# Altium project Memmory Address Register.PrjPcb
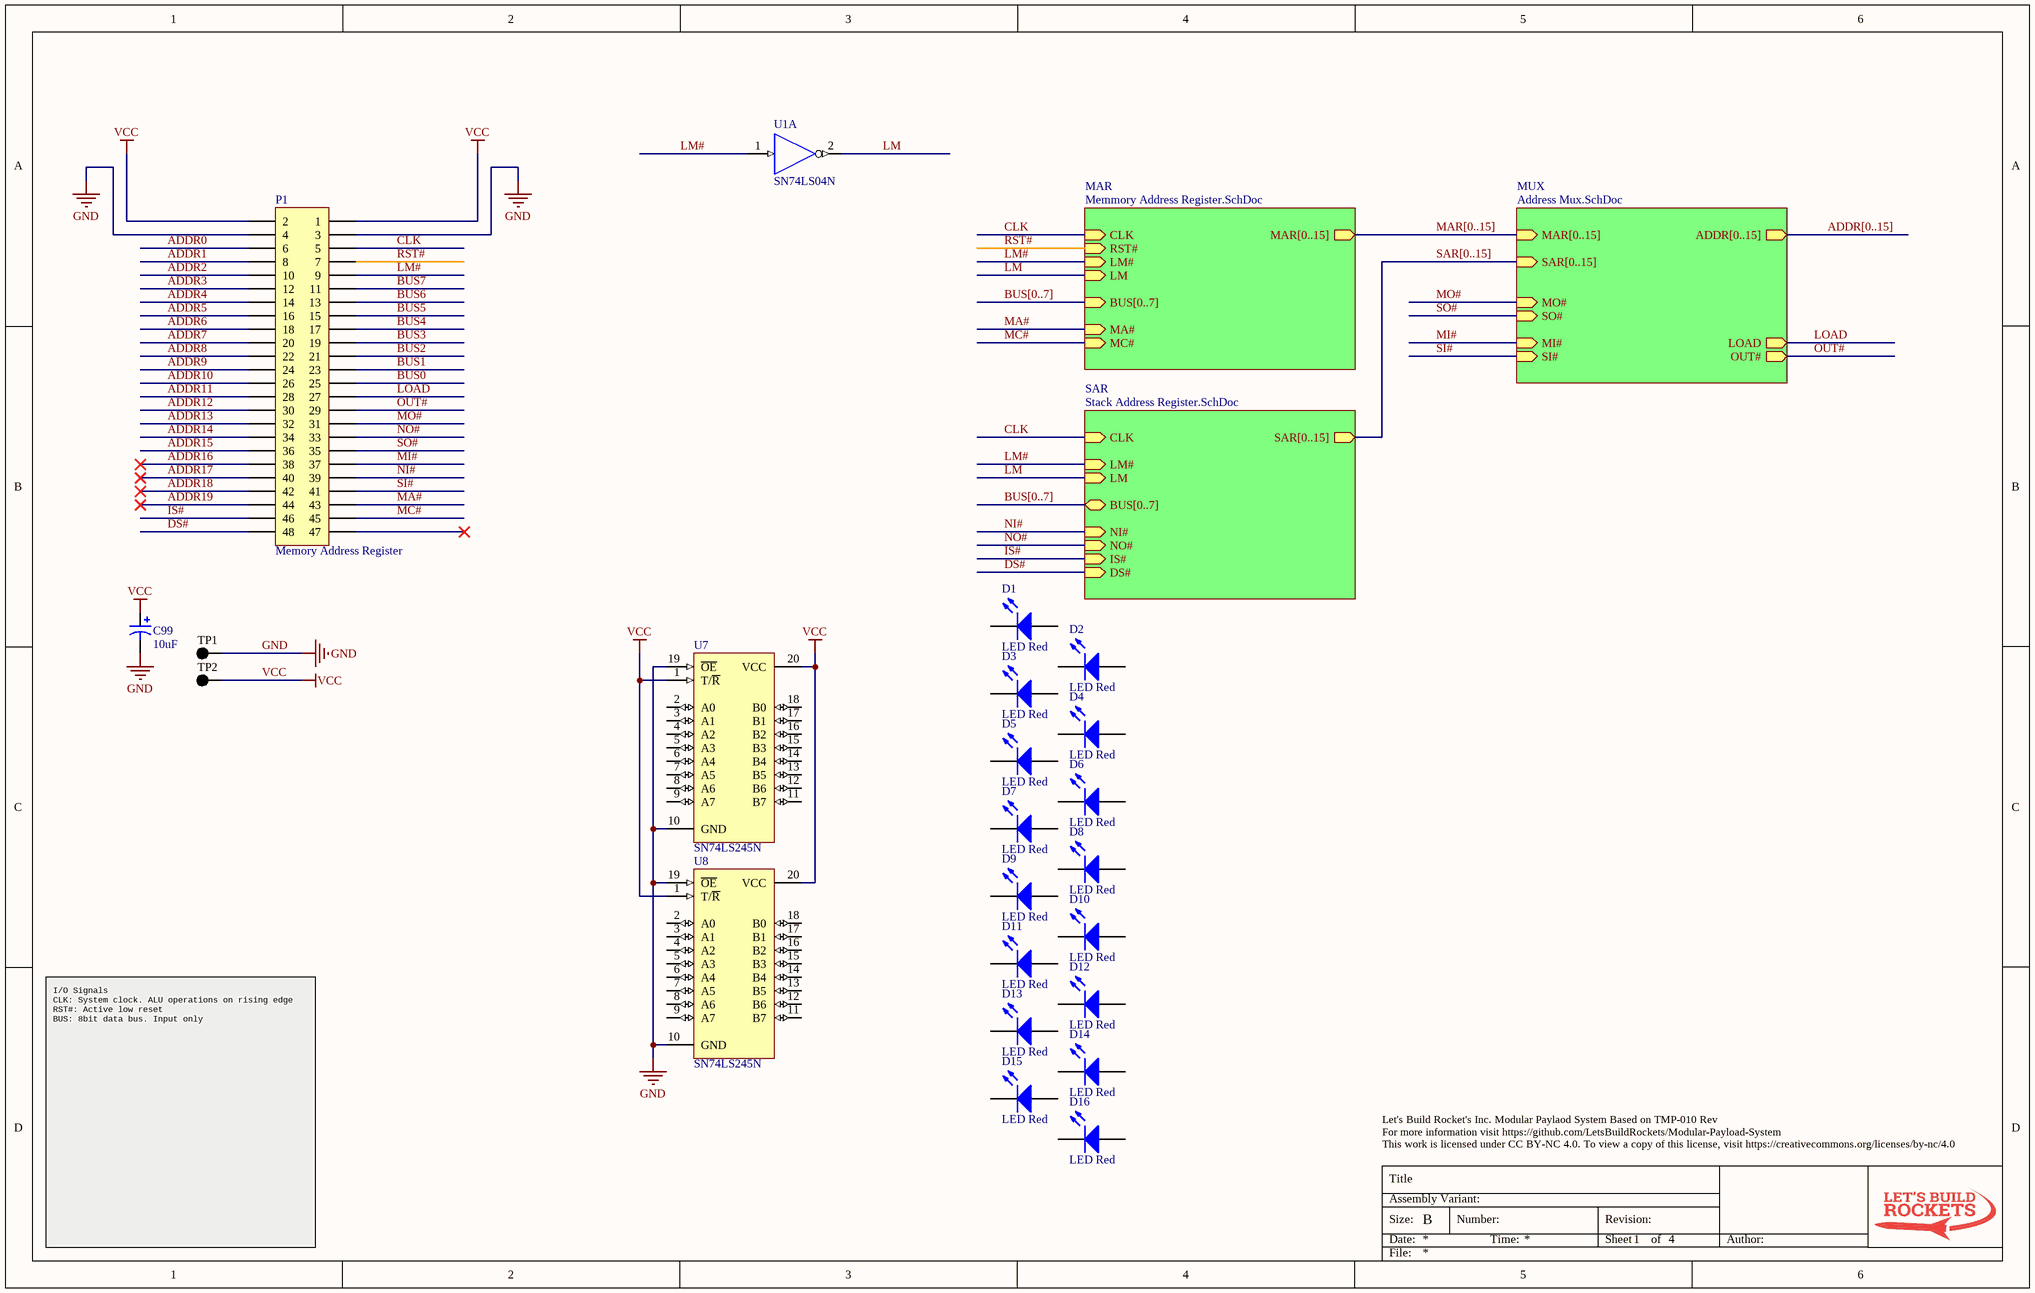
[diagram p0: Top.SchDoc]
4 sheets, 53 parts. Net scope: hierarchical (ports join the sheet entries above them; power ports are global).
Board file: Memmory Address Register.PcbDoc
Sheets:
  Top.SchDoc
    MAR = Memmory Address Register.SchDoc
    SAR = Stack Address Register.SchDoc
    MUX = Address Mux.SchDoc

## Sheet Top.SchDoc
size B; Author: E. Sims; Organization: Let's Build Rockets Inc.; SheetNumber: 1; SheetTotal: 4

### Parts
(Parts that share a designator on the sheet are numbered #1, #2 ... from top to bottom, then left to right.)
C99  value 10uF  [C5x7]  (hidden comment: Cap Pol5)
D1  LED Red  [LED 3mm RED]
D2  LED Red  [LED 3mm RED]
D3  LED Red  [LED 3mm RED]
D4  LED Red  [LED 3mm RED]
D5  LED Red  [LED 3mm RED]
D6  LED Red  [LED 3mm RED]
D7  LED Red  [LED 3mm RED]
D8  LED Red  [LED 3mm RED]
D9  LED Red  [LED 3mm RED]
D10  LED Red  [LED 3mm RED]
D11  LED Red  [LED 3mm RED]
D12  LED Red  [LED 3mm RED]
D13  LED Red  [LED 3mm RED]
D14  LED Red  [LED 3mm RED]
D15  LED Red  [LED 3mm RED]
D16  LED Red  [LED 3mm RED]
P1  Memory Address Register  [HDR2X24H]
TP1  (no value)  [KSTN-5011_V]
TP2  (no value)  [KSTN-5011_V]
U1#1  SN74LS04N  [N014]  (part A of 6)
U7  SN74LS245N  [N020]
U8  SN74LS245N  [N020]

### Sub-sheets
MAR = Memmory Address Register.SchDoc: CLK (in), MA# (in), LM# (in), MAR[0..15] (out), RST# (in), BUS[0..7] (in), MC# (in), LM (in)
MUX = Address Mux.SchDoc: MAR[0..15] (in), SAR[0..15] (in), ADDR[0..15] (out), LOAD (out), OUT# (out), MO# (in), SO# (in), MI# (in), SI# (in)
SAR = Stack Address Register.SchDoc: CLK (in), IS# (in), SAR[0..15] (out), DS# (in), NI# (in), BUS[0..7] (bidir), LM# (in), NO# (in), LM (in)

### Nets
GND: C99.2 P1.3 P1.4 TP1.1 U1#1.7(GND) U7.10(GND) U7.19(~{OE}) U8.10(GND) U8.19(~{OE})
VCC: C99.1 P1.1 P1.2 TP2.1 U1#1.14(VCC) U7.1(T/~{R}) U7.20(VCC) U8.1(T/~{R}) U8.20(VCC)
ADDR0: P1.6
ADDR1: P1.8
ADDR2: P1.10
ADDR3: P1.12
ADDR4: P1.14
ADDR5: P1.16
ADDR6: P1.18
ADDR7: P1.20
ADDR8: P1.22
ADDR9: P1.24
ADDR10: P1.26
ADDR11: P1.28
ADDR12: P1.30
ADDR13: P1.32
ADDR14: P1.34
ADDR15: P1.36
ADDR16: P1.38
ADDR17: P1.40
ADDR18: P1.42
ADDR19: P1.44
BUS0: P1.25
BUS1: P1.23
BUS2: P1.21
BUS3: P1.19
BUS4: P1.17
BUS5: P1.15
BUS6: P1.13
BUS7: P1.11
CLK: P1.5 ; sheet MAR/CLK, sheet SAR/CLK
DS#: P1.48 ; sheet SAR/DS#
IS#: P1.46 ; sheet SAR/IS#
LM: U1#1.2(Y) ; sheet MAR/LM, sheet SAR/LM
LM#: P1.9 U1#1.1(A) ; sheet MAR/LM#, sheet SAR/LM#
LOAD: P1.27 ; sheet MUX/LOAD
MA#: P1.43 ; sheet MAR/MA#
MC#: P1.45 ; sheet MAR/MC#
MI#: P1.37 ; sheet MUX/MI#
MO#: P1.31 ; sheet MUX/MO#
NI#: P1.39 ; sheet SAR/NI#
NO#: P1.33 ; sheet SAR/NO#
OUT#: P1.29 ; sheet MUX/OUT#
RST#: P1.7 ; sheet MAR/RST#
SI#: P1.41 ; sheet MUX/SI#
SO#: P1.35 ; sheet MUX/SO#

Not connected (* = marked no-connect by the designer): D1 1(A) 2(K); D2 1(A) 2(K); D3 1(A) 2(K); D4 1(A) 2(K); D5 1(A) 2(K); D6 1(A) 2(K); D7 1(A) 2(K); D8 1(A) 2(K); D9 1(A) 2(K); D10 1(A) 2(K); D11 1(A) 2(K); D12 1(A) 2(K); D13 1(A) 2(K); D14 1(A) 2(K); D15 1(A) 2(K); D16 1(A) 2(K); P1 47*; U7 2(A0) 3(A1) 4(A2) 5(A3) 6(A4) 7(A5) 8(A6) 9(A7) 11(B7) 12(B6) 13(B5) 14(B4) 15(B3) 16(B2) 17(B1) 18(B0); U8 2(A0) 3(A1) 4(A2) 5(A3) 6(A4) 7(A5) 8(A6) 9(A7) 11(B7) 12(B6) 13(B5) 14(B4) 15(B3) 16(B2) 17(B1) 18(B0)

### Buses and harness runs
bus ADDR[0..15] = sheet MUX/ADDR[0..15]
bus BUS[0..7] = sheet MAR/BUS[0..7]
bus BUS[0..7] = sheet SAR/BUS[0..7]
bus MAR[0..15] = sheet MAR/MAR[0..15] = sheet MUX/MAR[0..15]
bus SAR[0..15] = sheet MUX/SAR[0..15] = sheet SAR/SAR[0..15]

### Notes on the sheet
- I/O Signals
  CLK: System clock. ALU operations on rising edge
  RST#: Active low reset
  BUS: 8bit data bus. Input only
- Let's Build Rocket's Inc. Modular Paylaod System Based on TMP-010 Rev
  For more information visit https://github.com/LetsBuildRockets/Modular-Payload-System
  This work is licensed under CC BY-NC 4.0. To view a copy of this license, visit https://creativecommons.org/licenses/by-nc/4.0
- Title
- Size:
- Date:
- Assembly Variant:
- B
- Number:
- Time:
- Revision:
- Sheet
- of
- Author:
- File:

### Library data of the parts
C99 = Cap Pol5: Polarized Capacitor; Published: 8-Jun-2000; LatestRevisionDate: 17-Jul-2002; LatestRevisionNote: Re-released for DXP Platform.; PackageReference: POLAR0.8; Publisher: Altium Limited; PackageDescription: Polarized Capacitor; 2 Leads
D1-D16 = LED_Red
P1 = Header 24x2H: Header, 24-Pin, Dual row, Right Angle; System: Connector; LatestRevisionDate: 17-Jul-2002; LatestRevisionNote: Re-released for DXP Platform.; Publisher: Altium Limited
TP1 TP2 = CMP-1672-00003-4: Test Point, Black, Through Hole, RoHS, Bulk; Manufacturer: Keystone; ComponentLink2URL: http://www.keyelco.com/product-pdf.cfm?p=1320; Colour: Black; Pins: 1; REACH SVHC: No SVHC; ComponentLink1URL: http://www.keyelco.com/; PackageReference: 5011; Contact Plating: Silver; Package Quantity: 100; Packaging: Bulk; RoHSCompliant: true; Height: 8.12 mm; PackageDescription: 1-Pin Through Hole Device, Dia 3.17 mm; Mount: Through Hole; Mounting Technology: Through Hole; DatasheetVersion: Rev. F, 12/2013; ComponentLink1Description: Manufacturer URL; Contact Material: Bronze; ComponentLink2Description: Datasheet
U1#1 = SN74LS04N: Hex Inverter; Published: 8-Jun-2000; LatestRevisionDate: 04-Mar-2005; LatestRevisionNote: Stylized 3D Model Added.; DatasheetVersion: Mar-1988; PackageVersion: Oct-1995; PackageReference: N014; Publisher: Altium Limited; PackageDescription: DIP; 14 Leads; Row Spacing 7.62 mm; Pitch 2.54 mm; ComponentLink1Description: Manufacturer Link; ComponentLink1URL: http://www.ti.com/; ComponentLink2Description: Datasheet; ComponentLink2URL: http://www-s.ti.com/sc/ds/sn74ls04.pdf
U7 U8 = SN74LS245N: Octal Bus Transceiver with 3-State Outputs; Published: 8-Jun-2000; LatestRevisionDate: 04-Mar-2005; LatestRevisionNote: Stylized 3D Model Added.; DatasheetVersion: Mar-1988; PackageVersion: Oct-1995; PackageReference: N020; Publisher: Altium Limited; PackageDescription: DIP; 20 Leads; Row Spacing 7.62 mm; Pitch 2.54 mm; ComponentLink1Description: Manufacturer Link; ComponentLink1URL: http://www.ti.com/; ComponentLink2Description: Datasheet; ComponentLink2URL: http://www-s.ti.com/sc/ds/sn74ls245.pdf

## Sheet Memmory Address Register.SchDoc
size B; Author: E. Sims; Organization: Let's Build Rockets Inc.; SheetNumber: 2; SheetTotal: 2
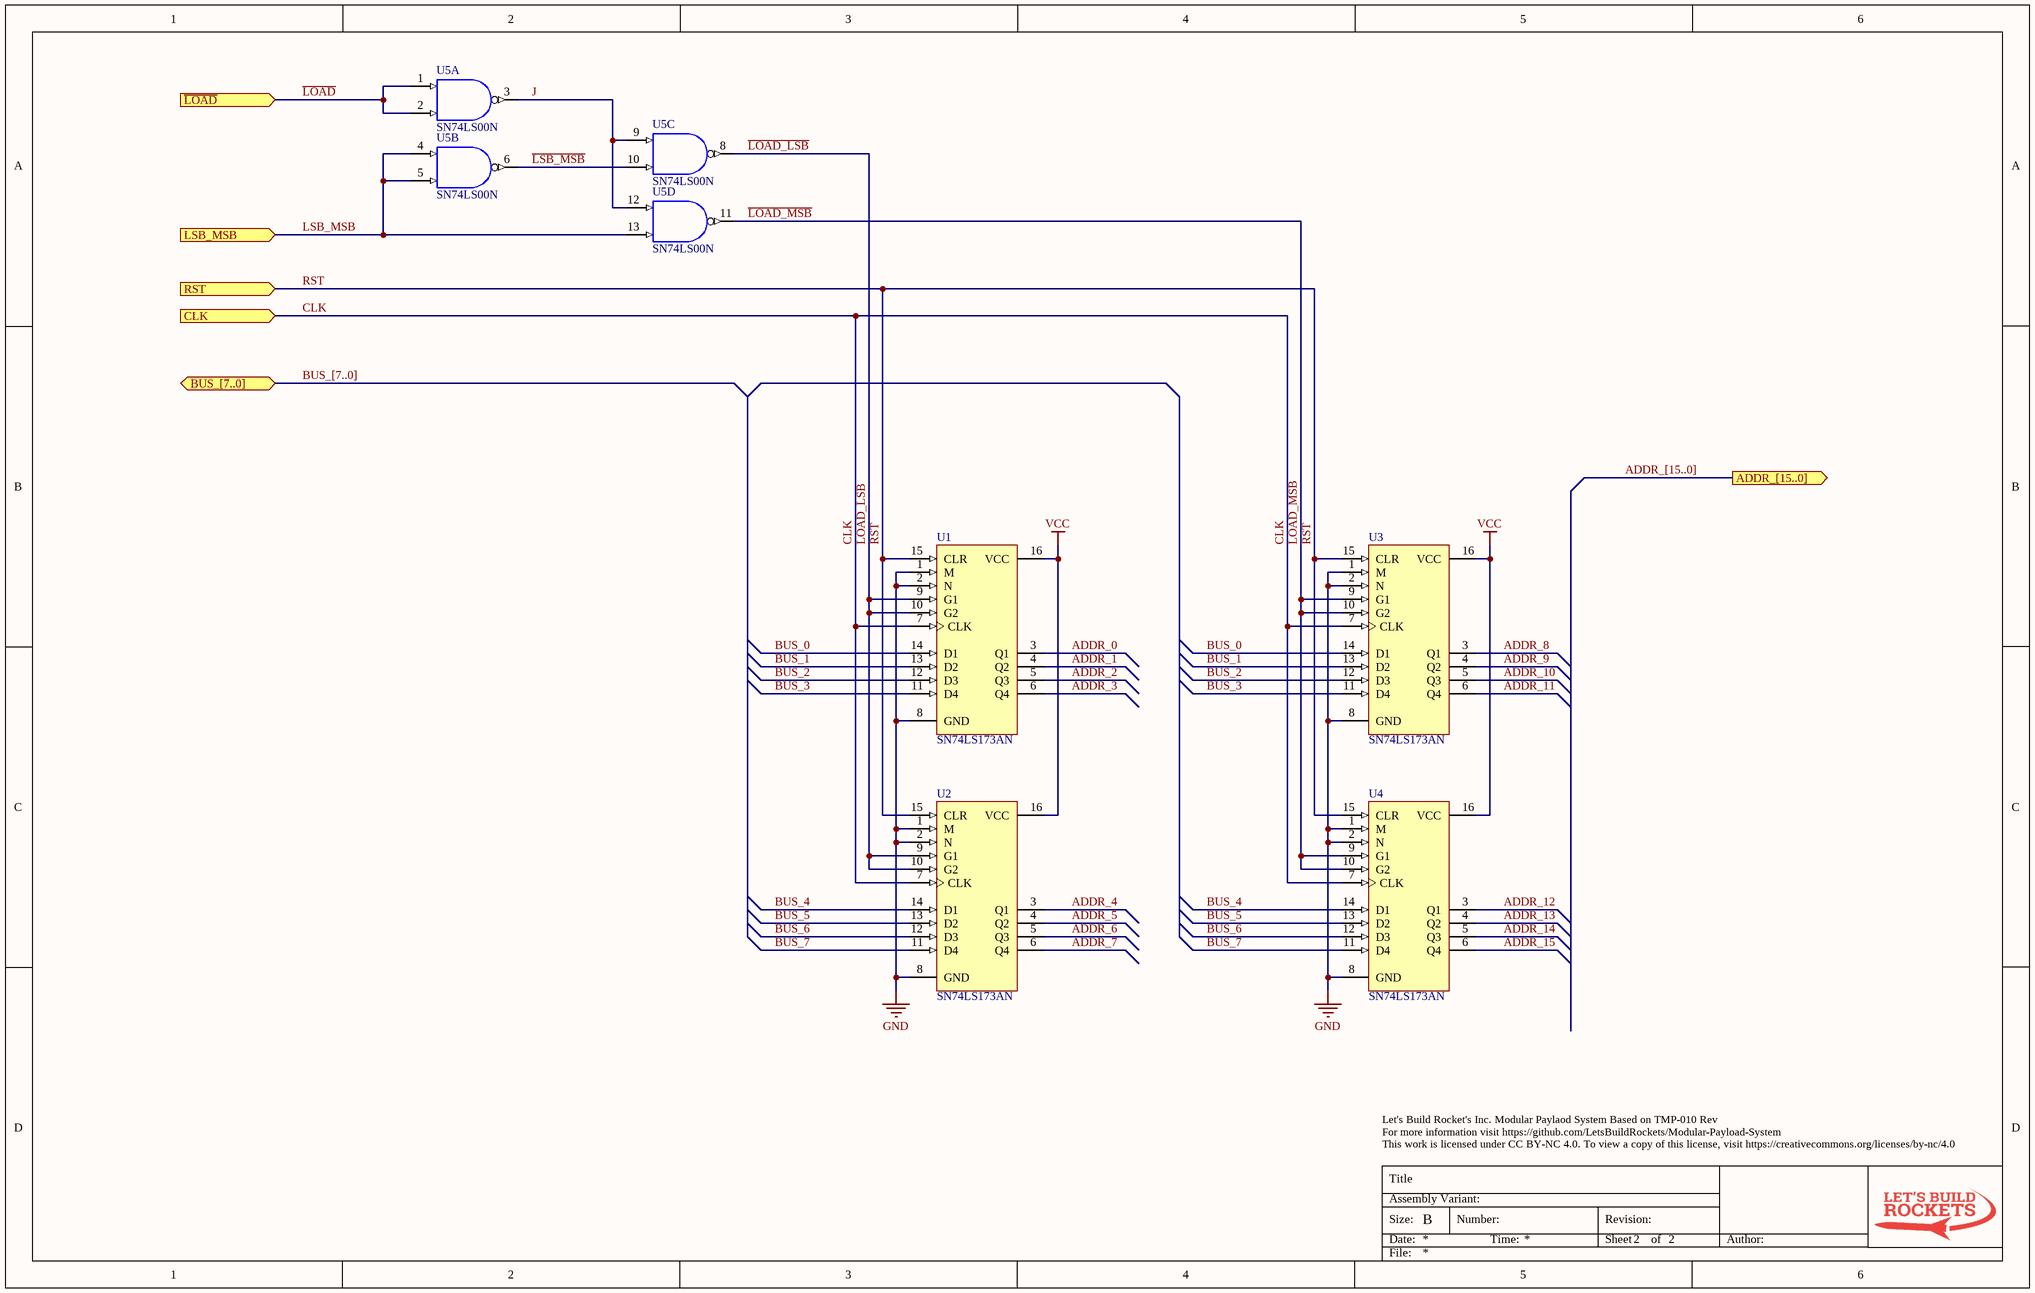
[diagram p1: Memmory Address Register.SchDoc]

### Parts
(Parts that share a designator on the sheet are numbered #1, #2 ... from top to bottom, then left to right.)
U1#2  SN74LS173AN  [N016D]
U2#1  SN74LS173AN  [N016D]
U3  SN74LS173AN  [N016D]
U4  SN74LS173AN  [N016D]
U5  SN74LS00N  [N014]  (parts A,B,C,D of 4)

### Ports
ADDR_[15..0] (out), BUS_[7..0] (bidir), CLK (in), LSB_MSB (in), RST (in), ~{LOAD} (in)

### Nets
GND: U1#2.1(M) U1#2.2(N) U1#2.8(GND) U2#1.1(M) U2#1.2(N) U2#1.8(GND) U3.1(M) U3.2(N) U3.8(GND) U4.1(M) U4.2(N) U4.8(GND) U5.7(GND)
VCC: U1#2.16(VCC) U2#1.16(VCC) U3.16(VCC) U4.16(VCC) U5.14(VCC)
ADDR_0: U1#2.3(Q1)
ADDR_1: U1#2.4(Q2)
ADDR_2: U1#2.5(Q3)
ADDR_3: U1#2.6(Q4)
ADDR_4: U2#1.3(Q1)
ADDR_5: U2#1.4(Q2)
ADDR_6: U2#1.5(Q3)
ADDR_7: U2#1.6(Q4)
ADDR_8: U3.3(Q1)
ADDR_9: U3.4(Q2)
ADDR_10: U3.5(Q3)
ADDR_11: U3.6(Q4)
ADDR_12: U4.3(Q1)
ADDR_13: U4.4(Q2)
ADDR_14: U4.5(Q3)
ADDR_15: U4.6(Q4)
BUS_0: U1#2.14(D1) U3.14(D1)
BUS_1: U1#2.13(D2) U3.13(D2)
BUS_2: U1#2.12(D3) U3.12(D3)
BUS_3: U1#2.11(D4) U3.11(D4)
BUS_4: U2#1.14(D1) U4.14(D1)
BUS_5: U2#1.13(D2) U4.13(D2)
BUS_6: U2#1.12(D3) U4.12(D3)
BUS_7: U2#1.11(D4) U4.11(D4)
CLK: U1#2.7(CLK) U2#1.7(CLK) U3.7(CLK) U4.7(CLK) ; port CLK
J: U5.3(Y) U5.9(A) U5.12(A)
~{LOAD}: U5.1(A) U5.2(B) ; port ~{LOAD}
~{LOAD_LSB}: U1#2.9(G1) U1#2.10(G2) U2#1.9(G1) U2#1.10(G2) U5.8(Y)
~{LOAD_MSB}: U3.9(G1) U3.10(G2) U4.9(G1) U4.10(G2) U5.11(Y)
~{LSB_MSB}: U5.6(Y) U5.10(B)
LSB_MSB: U5.4(A) U5.5(B) U5.13(B) ; port LSB_MSB
RST: U1#2.15(CLR) U2#1.15(CLR) U3.15(CLR) U4.15(CLR) ; port RST

### Buses and harness runs
bus ADDR_[15..0] = port ADDR_[15..0]
bus BUS_[7..0] = port BUS_[7..0]

### Notes on the sheet
- Let's Build Rocket's Inc. Modular Paylaod System Based on TMP-010 Rev
  For more information visit https://github.com/LetsBuildRockets/Modular-Payload-System
  This work is licensed under CC BY-NC 4.0. To view a copy of this license, visit https://creativecommons.org/licenses/by-nc/4.0
- Title
- Size:
- Date:
- Assembly Variant:
- B
- Number:
- Time:
- Revision:
- Sheet
- of
- Author:
- File:

### Library data of the parts
U1#2 U2#1 U3 U4 = SN74LS173AN: 4-Bit D-Type Register with 3-State Outputs; Published: 8-Jun-2000; LatestRevisionDate: 04-Mar-2005; LatestRevisionNote: Stylized 3D Model Added.; DatasheetVersion: Mar-1988; PackageVersion: Oct-1995; PackageReference: N016D; Publisher: Altium Limited; PackageDescription: DIP; 16 Leads; Row Spacing 7.62 mm; Pitch 2.54 mm; Code_JEDEC: MS-001-BB; ComponentLink1Description: Manufacturer Link; ComponentLink1URL: http://www.ti.com/; ComponentLink2Description: Datasheet; ComponentLink2URL: http://www-s.ti.com/sc/ds/sn74ls173a.pdf
U5 = SN74LS00N: Quadruple 2-Input Positive-NAND Gate; Published: 8-Jun-2000; LatestRevisionDate: 04-Mar-2005; LatestRevisionNote: Stylized 3D Model Added.; DatasheetVersion: Mar-1988; PackageVersion: Oct-1995; PackageReference: N014; Publisher: Altium Limited; PackageDescription: DIP; 14 Leads; Row Spacing 7.62 mm; Pitch 2.54 mm; ComponentLink1Description: Manufacturer Link; ComponentLink1URL: http://www.ti.com/; ComponentLink2Description: Datasheet; ComponentLink2URL: http://www-s.ti.com/sc/ds/sn74ls00.pdf

## Sheet Stack Address Register.SchDoc
size C portrait; Author: E. Sims; Organization: Let's Build Rockets Inc.; SheetNumber: 3; SheetTotal: 4
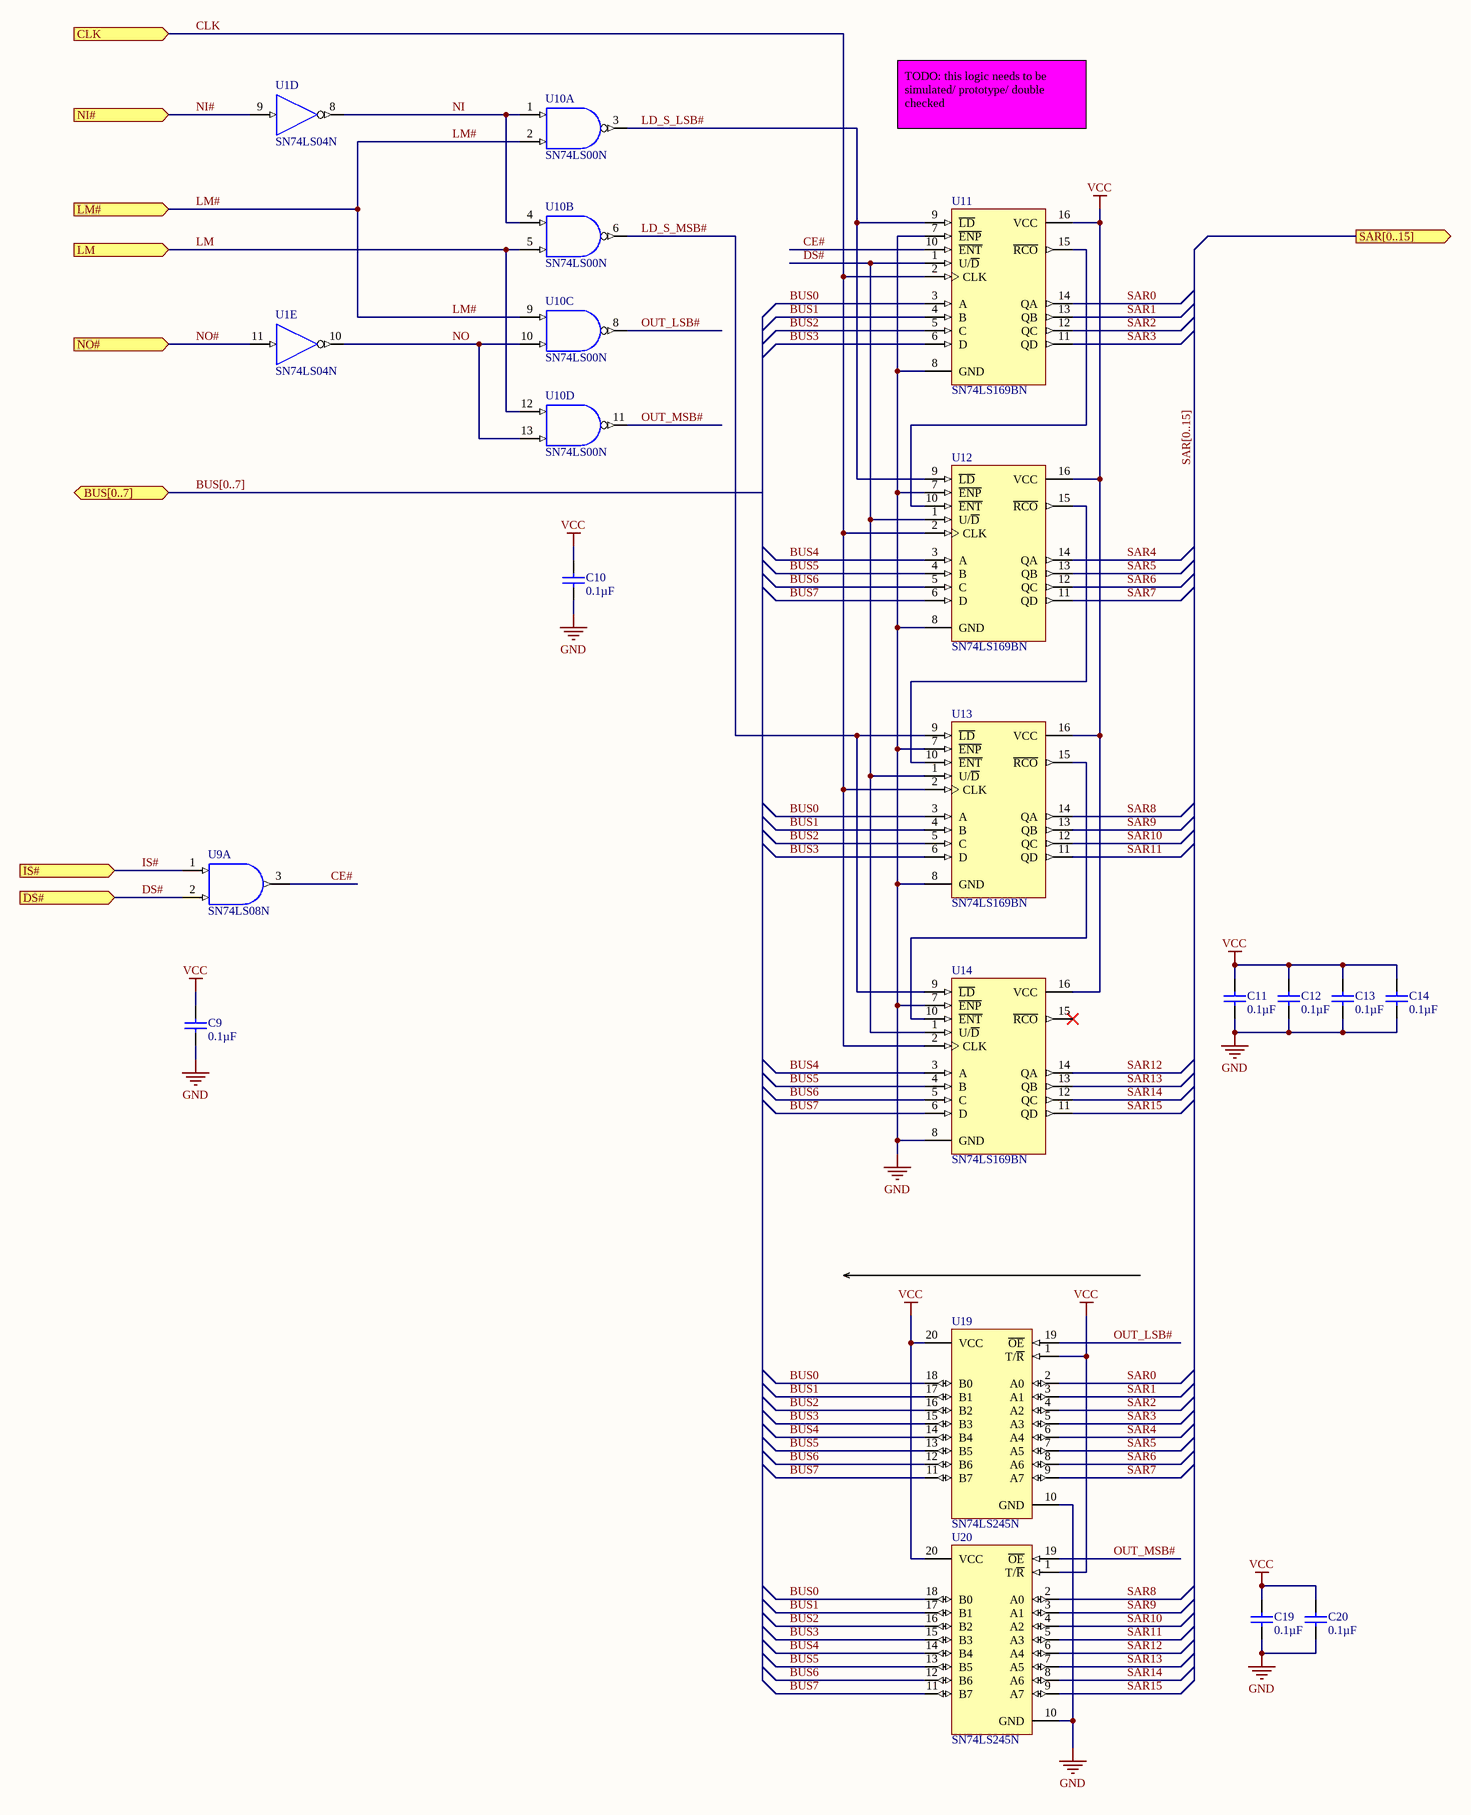
[diagram p2: Stack Address Register.SchDoc]

### Parts
(Parts that share a designator on the sheet are numbered #1, #2 ... from top to bottom, then left to right.)
C9  Capacitance: 0.1µF  [VISH-K104K15X7RF5TL2]  (hidden comment: K104K15X7RF5TL2)
C10  Capacitance: 0.1µF  [VISH-K104K15X7RF5TL2]  (hidden comment: K104K15X7RF5TL2)
C11  Capacitance: 0.1µF  [VISH-K104K15X7RF5TL2]  (hidden comment: K104K15X7RF5TL2)
C12  Capacitance: 0.1µF  [VISH-K104K15X7RF5TL2]  (hidden comment: K104K15X7RF5TL2)
C13  Capacitance: 0.1µF  [VISH-K104K15X7RF5TL2]  (hidden comment: K104K15X7RF5TL2)
C14  Capacitance: 0.1µF  [VISH-K104K15X7RF5TL2]  (hidden comment: K104K15X7RF5TL2)
C19  Capacitance: 0.1µF  [VISH-K104K15X7RF5TL2]  (hidden comment: K104K15X7RF5TL2)
C20  Capacitance: 0.1µF  [VISH-K104K15X7RF5TL2]  (hidden comment: K104K15X7RF5TL2)
U1#1  SN74LS04N  [N014]  (parts D,E of 6)
U9  SN74LS08N  [N014]  (part A of 4)
U10  SN74LS00N  [N014]  (parts A,B,C,D of 4)
U11  SN74LS169BN  [N016]
U12  SN74LS169BN  [N016]
U13  SN74LS169BN  [N016]
U14  SN74LS169BN  [N016]
U19  SN74LS245N  [N020]
U20  SN74LS245N  [N020]

### Ports
BUS[0..7] (bidir), CLK (in), DS# (in), IS# (in), LM (in), LM# (in), NI# (in), NO# (in), SAR[0..15] (out)

### Nets
GND: C9.2 C10.2 C11.2 C12.2 C13.2 C14.2 C19.2 C20.2 U1#1.7(GND) U9.7(GND) U10.7(GND) U11.7(~{ENP}) U11.8(GND) U12.7(~{ENP}) U12.8(GND) U13.7(~{ENP}) U13.8(GND) U14.7(~{ENP}) U14.8(GND) U19.10(GND) U20.10(GND)
VCC: C9.1 C10.1 C11.1 C12.1 C13.1 C14.1 C19.1 C20.1 U1#1.14(VCC) U9.14(VCC) U10.14(VCC) U11.16(VCC) U12.16(VCC) U13.16(VCC) U14.16(VCC) U19.1(T/~{R}) U19.20(VCC) U20.1(T/~{R}) U20.20(VCC)
BUS0: U11.3(A) U13.3(A) U19.18(B0) U20.18(B0)
BUS1: U11.4(B) U13.4(B) U19.17(B1) U20.17(B1)
BUS2: U11.5(C) U13.5(C) U19.16(B2) U20.16(B2)
BUS3: U11.6(D) U13.6(D) U19.15(B3) U20.15(B3)
BUS4: U12.3(A) U14.3(A) U19.14(B4) U20.14(B4)
BUS5: U12.4(B) U14.4(B) U19.13(B5) U20.13(B5)
BUS6: U12.5(C) U14.5(C) U19.12(B6) U20.12(B6)
BUS7: U12.6(D) U14.6(D) U19.11(B7) U20.11(B7)
CE#: U9.3(Y) U11.10(~{ENT})
CLK: U11.2(CLK) U12.2(CLK) U13.2(CLK) U14.2(CLK) ; port CLK
DS#: U9.2(B) U11.1(U/~{D}) U12.1(U/~{D}) U13.1(U/~{D}) U14.1(U/~{D}) ; port DS#
IS#: U9.1(A) ; port IS#
LD_S_LSB#: U10.3(Y) U11.9(~{LD}) U12.9(~{LD})
LD_S_MSB#: U10.6(Y) U13.9(~{LD}) U14.9(~{LD})
LM: U10.5(B) U10.12(A) ; port LM
LM#: U10.2(B) U10.9(A) ; port LM#
NI: U1#1.8(Y) U10.1(A) U10.4(A)
NI#: U1#1.9(A) ; port NI#
NO: U1#1.10(Y) U10.10(B) U10.13(B)
NO#: U1#1.11(A) ; port NO#
OUT_LSB#: U10.8(Y) U19.19(~{OE})
OUT_MSB#: U10.11(Y) U20.19(~{OE})
SAR0: U11.14(QA) U19.2(A0)
SAR1: U11.13(QB) U19.3(A1)
SAR2: U11.12(QC) U19.4(A2)
SAR3: U11.11(QD) U19.5(A3)
SAR4: U12.14(QA) U19.6(A4)
SAR5: U12.13(QB) U19.7(A5)
SAR6: U12.12(QC) U19.8(A6)
SAR7: U12.11(QD) U19.9(A7)
SAR8: U13.14(QA) U20.2(A0)
SAR9: U13.13(QB) U20.3(A1)
SAR10: U13.12(QC) U20.4(A2)
SAR11: U13.11(QD) U20.5(A3)
SAR12: U14.14(QA) U20.6(A4)
SAR13: U14.13(QB) U20.7(A5)
SAR14: U14.12(QC) U20.8(A6)
SAR15: U14.11(QD) U20.9(A7)
NetU11_15: U11.15(~{RCO}) U12.10(~{ENT})
NetU12_15: U12.15(~{RCO}) U13.10(~{ENT})
NetU13_15: U13.15(~{RCO}) U14.10(~{ENT})

Not connected (* = marked no-connect by the designer): U14 15(~{RCO})*

### Buses and harness runs
bus BUS[0..7] = port BUS[0..7]
bus SAR[0..15] = port SAR[0..15]

### Notes on the sheet
- TODO: this logic needs to be simulated/ prototype/ double checked
- Let's Build Rocket's Inc. Modular Paylaod System Based on TMP-010 Rev
  For more information visit https://github.com/LetsBuildRockets/Modular-Payload-System
  This work is licensed under CC BY-NC 4.0. To view a copy of this license, visit https://creativecommons.org/licenses/by-nc/4.0
- Title
- Size:
- Date:
- Assembly Variant:
- B
- Number:
- Time:
- Revision:
- Sheet
- of
- Author:
- File:

### Library data of the parts
C9-C14 C19 C20 = CMP-2000-06508-1: Ceramic Capacitor, 100 nF, +/- 10%, 50 V, -55 to 125 degC, 2-Pin THD, RoHS, Tape and Reel; Manufacturer: Vishay; Other Names: BC1084CT; Catalog Drawings: Mono-KapSide2-15_5.58Mono-KapSide1_15; Temperature Coefficient: X7R; Voltage - Rated: 50V; Online Catalog: Mono-Kap™Series; Size / Dimension: 0.157"Lx0.098"W(4.00mmx2.50mm); Operating Temperature: -55°C~125°C; Family: CeramicCapacitors; Manufacturer URL: http://www.vishay.com/; Standard Package: 1; Thickness (Max): -; Ratings: -; Datasheet Version: 08/2013; Package Description: 2-Pin Through Hole Device, Body 4 x 2.6 mm; Mounting Type: ThroughHole; Features: -; Lead Spacing: 0.098"(2.50mm); Tolerance: ±10%; Category: Capacitors; Mounting Technology: ThroughHole; Lead Style: Straight; Datasheet URL: http://www.vishay.com/docs/45171/kseries.pdf; Applications: GeneralPurpose; Package / Case: Radial; Height - Seated (Max): 0.220"(5.58mm); Package Reference: K104K15X7RF5TL2; Series: Mono-Kap™K; Packaging: CutTape(CT)
U1#1 = SN74LS04N: Hex Inverter; Published: 8-Jun-2000; LatestRevisionDate: 04-Mar-2005; LatestRevisionNote: Stylized 3D Model Added.; DatasheetVersion: Mar-1988; PackageVersion: Oct-1995; PackageReference: N014; Publisher: Altium Limited; PackageDescription: DIP; 14 Leads; Row Spacing 7.62 mm; Pitch 2.54 mm; ComponentLink1Description: Manufacturer Link; ComponentLink1URL: http://www.ti.com/; ComponentLink2Description: Datasheet; ComponentLink2URL: http://www-s.ti.com/sc/ds/sn74ls04.pdf
U9 = SN74LS08N: Quadruple 2-Input Positive-AND Gate; Published: 8-Jun-2000; LatestRevisionDate: 04-Mar-2005; LatestRevisionNote: Stylized 3D Model Added.; DatasheetVersion: Mar-1988; PackageVersion: Oct-1995; PackageReference: N014; Publisher: Altium Limited; PackageDescription: DIP; 14 Leads; Row Spacing 7.62 mm; Pitch 2.54 mm; ComponentLink1Description: Manufacturer Link; ComponentLink1URL: http://www.ti.com/; ComponentLink2Description: Datasheet; ComponentLink2URL: http://www-s.ti.com/sc/ds/SN74LS08.pdf
U10 = SN74LS00N: Quadruple 2-Input Positive-NAND Gate; Published: 8-Jun-2000; LatestRevisionDate: 04-Mar-2005; LatestRevisionNote: Stylized 3D Model Added.; DatasheetVersion: Mar-1988; PackageVersion: Oct-1995; PackageReference: N014; Publisher: Altium Limited; PackageDescription: DIP; 14 Leads; Row Spacing 7.62 mm; Pitch 2.54 mm; ComponentLink1Description: Manufacturer Link; ComponentLink1URL: http://www.ti.com/; ComponentLink2Description: Datasheet; ComponentLink2URL: http://www-s.ti.com/sc/ds/sn74ls00.pdf
U11-U14 = SN74LS169BN: Synchronous 4-Bit Up/Down Binary Counter; Published: 8-Jun-2000; LatestRevisionDate: 04-Mar-2005; LatestRevisionNote: Stylized 3D Model Added.; DatasheetVersion: Mar-1988; PackageVersion: Oct-1995; PackageReference: N016; Publisher: Altium Limited; PackageDescription: DIP; 16 Leads; Row Spacing 7.62 mm; Pitch 2.54 mm; Code_JEDEC: MS-001-BB; ComponentLink1Description: Manufacturer Link; ComponentLink1URL: http://www.ti.com/; ComponentLink2Description: Datasheet; ComponentLink2URL: http://www-s.ti.com/sc/ds/sn74ls169b.pdf
U19 U20 = SN74LS245N: as U7 on sheet Top; Published: 8-Jun-2000; LatestRevisionDate: 04-Mar-2005; LatestRevisionNote: Stylized 3D Model Added.; DatasheetVersion: Mar-1988; PackageVersion: Oct-1995; PackageReference: N020; Publisher: Altium Limited; PackageDescription: DIP; 20 Leads; Row Spacing 7.62 mm; Pitch 2.54 mm; ComponentLink1Description: Manufacturer Link; ComponentLink1URL: http://www.ti.com/; ComponentLink2Description: Datasheet; ComponentLink2URL: http://www-s.ti.com/sc/ds/sn74ls245.pdf

## Sheet Address Mux.SchDoc
size B; Author: E. Sims; Organization: Let's Build Rockets Inc.; SheetNumber: 4; SheetTotal: 4
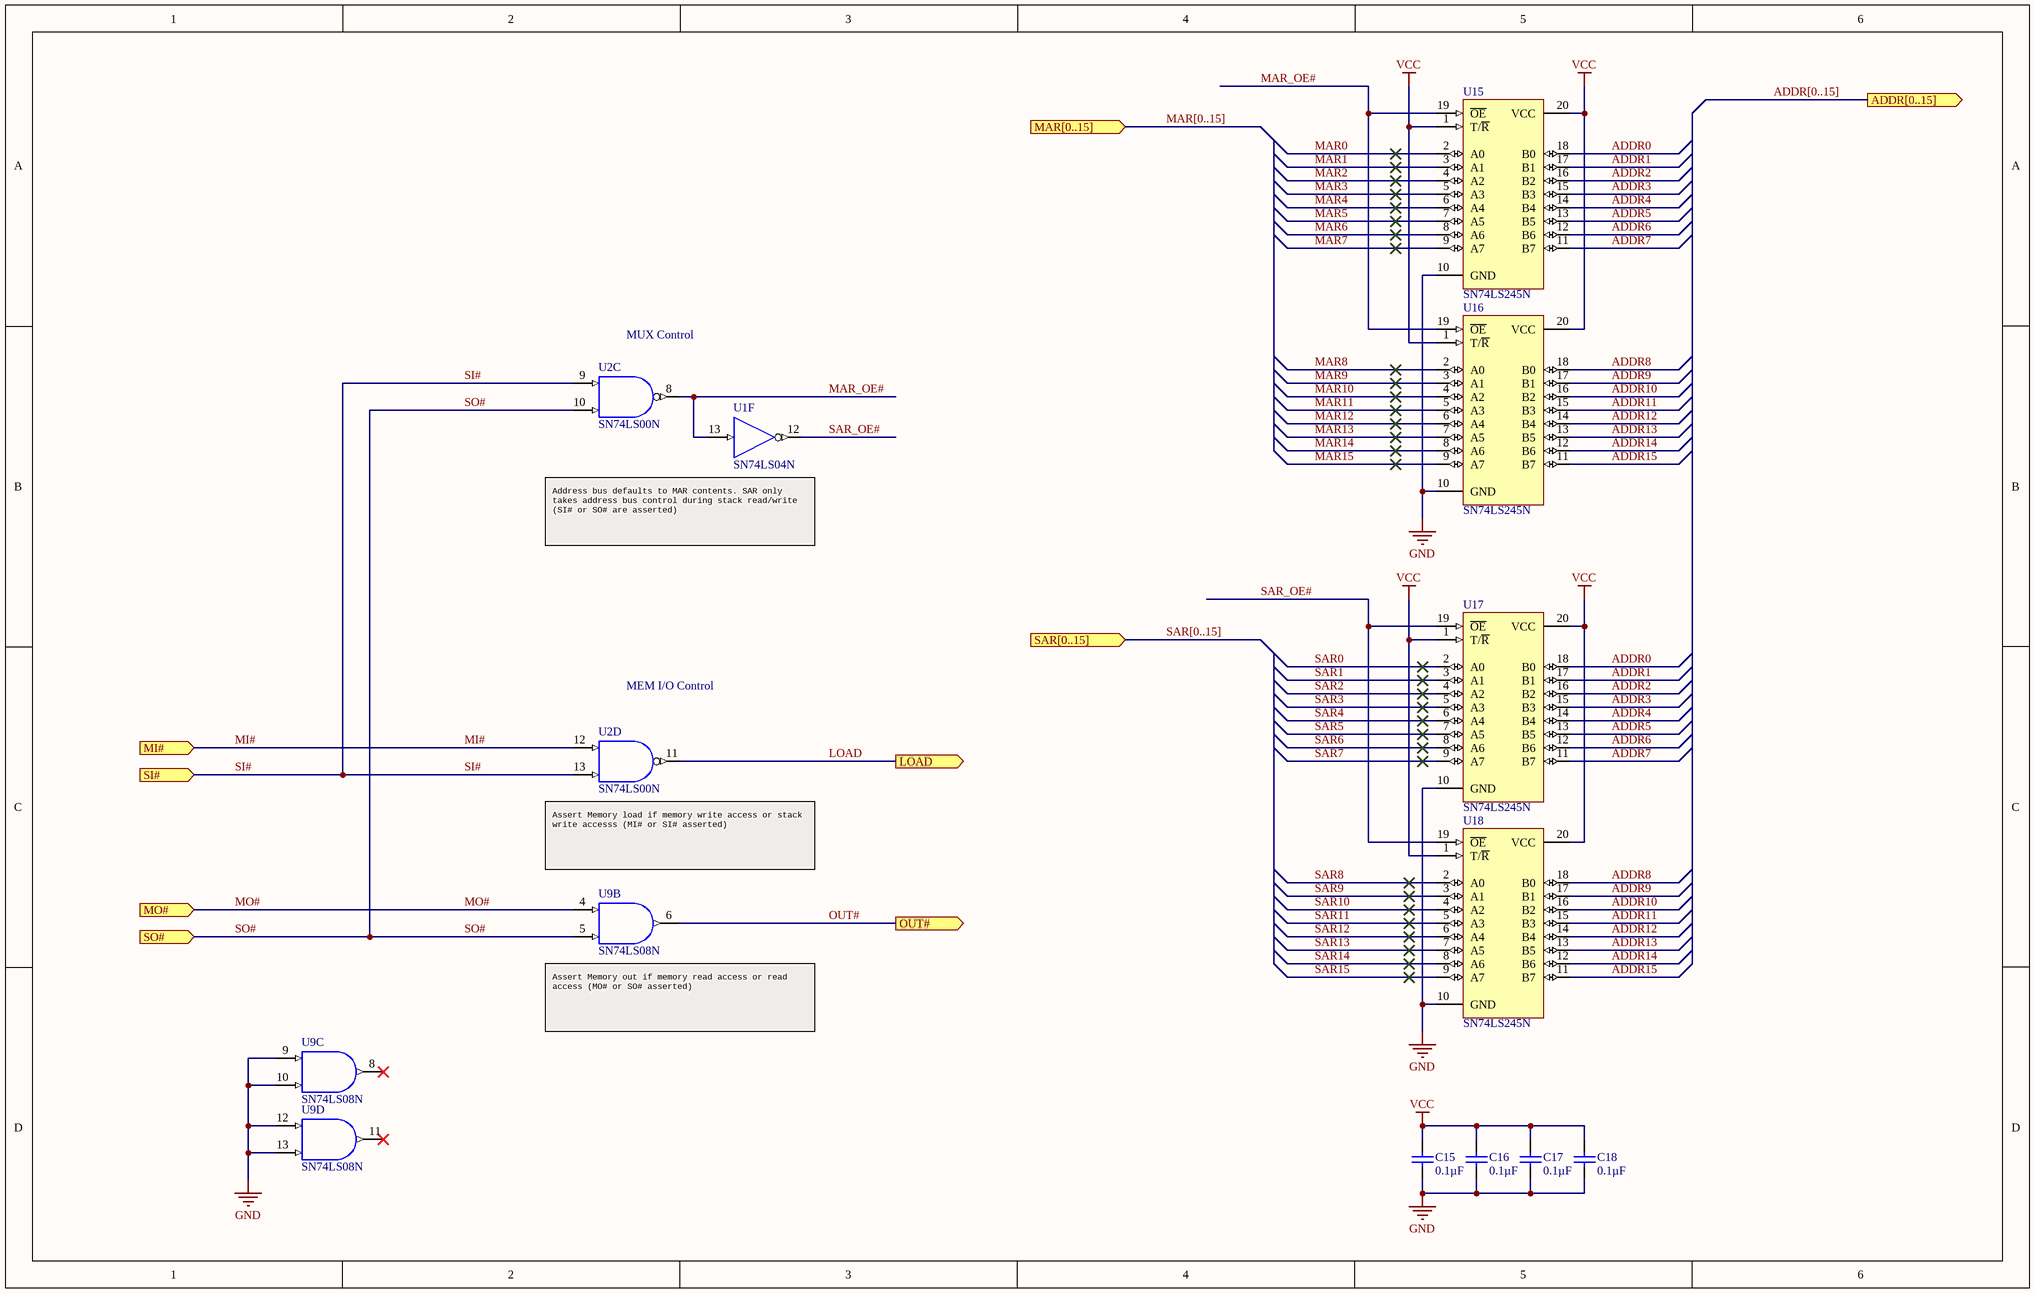
[diagram p3: Address Mux.SchDoc]

### Parts
(Parts that share a designator on the sheet are numbered #1, #2 ... from top to bottom, then left to right.)
C15  Capacitance: 0.1µF  [VISH-K104K15X7RF5TL2]  (hidden comment: K104K15X7RF5TL2)
C16  Capacitance: 0.1µF  [VISH-K104K15X7RF5TL2]  (hidden comment: K104K15X7RF5TL2)
C17  Capacitance: 0.1µF  [VISH-K104K15X7RF5TL2]  (hidden comment: K104K15X7RF5TL2)
C18  Capacitance: 0.1µF  [VISH-K104K15X7RF5TL2]  (hidden comment: K104K15X7RF5TL2)
U1#1  SN74LS04N  [N014]  (part F of 6)
U2#2  SN74LS00N  [N014]  (parts C,D of 4)
U9  SN74LS08N  [N014]  (parts B,C,D of 4)
U15  SN74LS245N  [N020]
U16  SN74LS245N  [N020]
U17  SN74LS245N  [N020]
U18  SN74LS245N  [N020]

### Ports
ADDR[0..15] (out), LOAD (out), MAR[0..15] (in), MI# (in), MO# (in), OUT# (out), SAR[0..15] (in), SI# (in), SO# (in)

### Nets
GND: C15.2 C16.2 C17.2 C18.2 U1#1.7(GND) U2#2.7(GND) U9.7(GND) U9.9(A) U9.10(B) U9.12(A) U9.13(B) U15.10(GND) U16.10(GND) U17.10(GND) U18.10(GND)
VCC: C15.1 C16.1 C17.1 C18.1 U1#1.14(VCC) U2#2.14(VCC) U9.14(VCC) U15.1(T/~{R}) U15.20(VCC) U16.1(T/~{R}) U16.20(VCC) U17.1(T/~{R}) U17.20(VCC) U18.1(T/~{R}) U18.20(VCC)
ADDR0: U15.18(B0) U17.18(B0)
ADDR1: U15.17(B1) U17.17(B1)
ADDR2: U15.16(B2) U17.16(B2)
ADDR3: U15.15(B3) U17.15(B3)
ADDR4: U15.14(B4) U17.14(B4)
ADDR5: U15.13(B5) U17.13(B5)
ADDR6: U15.12(B6) U17.12(B6)
ADDR7: U15.11(B7) U17.11(B7)
ADDR8: U16.18(B0) U18.18(B0)
ADDR9: U16.17(B1) U18.17(B1)
ADDR10: U16.16(B2) U18.16(B2)
ADDR11: U16.15(B3) U18.15(B3)
ADDR12: U16.14(B4) U18.14(B4)
ADDR13: U16.13(B5) U18.13(B5)
ADDR14: U16.12(B6) U18.12(B6)
ADDR15: U16.11(B7) U18.11(B7)
LOAD: U2#2.11(Y) ; port LOAD
MAR0: U15.2(A0)
MAR1: U15.3(A1)
MAR2: U15.4(A2)
MAR3: U15.5(A3)
MAR4: U15.6(A4)
MAR5: U15.7(A5)
MAR6: U15.8(A6)
MAR7: U15.9(A7)
MAR8: U16.2(A0)
MAR9: U16.3(A1)
MAR10: U16.4(A2)
MAR11: U16.5(A3)
MAR12: U16.6(A4)
MAR13: U16.7(A5)
MAR14: U16.8(A6)
MAR15: U16.9(A7)
MAR_OE#: U1#1.13(A) U2#2.8(Y) U15.19(~{OE}) U16.19(~{OE})
MI#: U2#2.12(A) ; port MI#
MO#: U9.4(A) ; port MO#
OUT#: U9.6(Y) ; port OUT#
SAR0: U17.2(A0)
SAR1: U17.3(A1)
SAR2: U17.4(A2)
SAR3: U17.5(A3)
SAR4: U17.6(A4)
SAR5: U17.7(A5)
SAR6: U17.8(A6)
SAR7: U17.9(A7)
SAR8: U18.2(A0)
SAR9: U18.3(A1)
SAR10: U18.4(A2)
SAR11: U18.5(A3)
SAR12: U18.6(A4)
SAR13: U18.7(A5)
SAR14: U18.8(A6)
SAR15: U18.9(A7)
SAR_OE#: U1#1.12(Y) U17.19(~{OE}) U18.19(~{OE})
SI#: U2#2.9(A) U2#2.13(B) ; port SI#
SO#: U2#2.10(B) U9.5(B) ; port SO#

Not connected (* = marked no-connect by the designer): U9 8(Y)* 11(Y)*

### Buses and harness runs
bus ADDR[0..15] = port ADDR[0..15]
bus MAR[0..15] = port MAR[0..15]
bus SAR[0..15] = port SAR[0..15]

### Notes on the sheet
- (near U2#2) MUX Control
- (near U1#1) Address bus defaults to MAR contents. SAR only takes address bus control during stack read/write (SI# or SO# are asserted)
- MEM I/O Control
- Assert Memory load if memory write access or stack write accesss (MI# or SI# asserted)
- (near U9) Assert Memory out if memory read access or read access (MO# or SO# asserted)
- Let's Build Rocket's Inc. Modular Paylaod System Based on TMP-010 Rev
  For more information visit https://github.com/LetsBuildRockets/Modular-Payload-System
  This work is licensed under CC BY-NC 4.0. To view a copy of this license, visit https://creativecommons.org/licenses/by-nc/4.0
- Title
- Size:
- Date:
- Assembly Variant:
- B
- Number:
- Time:
- Revision:
- Sheet
- of
- Author:
- File:

### Library data of the parts
C15-C18 = CMP-2000-06508-1: as C9 on sheet Stack Address Register; Size / Dimension: 0.157"Lx0.098"W(4.00mmx2.50mm); Operating Temperature: -55°C~125°C; Family: CeramicCapacitors; Manufacturer URL: http://www.vishay.com/; Standard Package: 1; Thickness (Max): -; Ratings: -; Datasheet Version: 08/2013; Package Description: 2-Pin Through Hole Device, Body 4 x 2.6 mm; Mounting Type: ThroughHole; Features: -; Lead Spacing: 0.098"(2.50mm); Tolerance: ±10%; Category: Capacitors; Mounting Technology: ThroughHole; Lead Style: Straight; Datasheet URL: http://www.vishay.com/docs/45171/kseries.pdf; Applications: GeneralPurpose; Package / Case: Radial; Height - Seated (Max): 0.220"(5.58mm); Package Reference: K104K15X7RF5TL2; Series: Mono-Kap™K; Packaging: CutTape(CT)
U1#1 = SN74LS04N: Hex Inverter; Published: 8-Jun-2000; LatestRevisionDate: 04-Mar-2005; LatestRevisionNote: Stylized 3D Model Added.; DatasheetVersion: Mar-1988; PackageVersion: Oct-1995; PackageReference: N014; Publisher: Altium Limited; PackageDescription: DIP; 14 Leads; Row Spacing 7.62 mm; Pitch 2.54 mm; ComponentLink1Description: Manufacturer Link; ComponentLink1URL: http://www.ti.com/; ComponentLink2Description: Datasheet; ComponentLink2URL: http://www-s.ti.com/sc/ds/sn74ls04.pdf
U2#2 = SN74LS00N: Quadruple 2-Input Positive-NAND Gate; Published: 8-Jun-2000; LatestRevisionDate: 04-Mar-2005; LatestRevisionNote: Stylized 3D Model Added.; DatasheetVersion: Mar-1988; PackageVersion: Oct-1995; PackageReference: N014; Publisher: Altium Limited; PackageDescription: DIP; 14 Leads; Row Spacing 7.62 mm; Pitch 2.54 mm; ComponentLink1Description: Manufacturer Link; ComponentLink1URL: http://www.ti.com/; ComponentLink2Description: Datasheet; ComponentLink2URL: http://www-s.ti.com/sc/ds/sn74ls00.pdf
U9 = SN74LS08N: Quadruple 2-Input Positive-AND Gate; Published: 8-Jun-2000; LatestRevisionDate: 04-Mar-2005; LatestRevisionNote: Stylized 3D Model Added.; DatasheetVersion: Mar-1988; PackageVersion: Oct-1995; PackageReference: N014; Publisher: Altium Limited; PackageDescription: DIP; 14 Leads; Row Spacing 7.62 mm; Pitch 2.54 mm; ComponentLink1Description: Manufacturer Link; ComponentLink1URL: http://www.ti.com/; ComponentLink2Description: Datasheet; ComponentLink2URL: http://www-s.ti.com/sc/ds/SN74LS08.pdf
U15-U18 = SN74LS245N: as U7 on sheet Top; Published: 8-Jun-2000; LatestRevisionDate: 04-Mar-2005; LatestRevisionNote: Stylized 3D Model Added.; DatasheetVersion: Mar-1988; PackageVersion: Oct-1995; PackageReference: N020; Publisher: Altium Limited; PackageDescription: DIP; 20 Leads; Row Spacing 7.62 mm; Pitch 2.54 mm; ComponentLink1Description: Manufacturer Link; ComponentLink1URL: http://www.ti.com/; ComponentLink2Description: Datasheet; ComponentLink2URL: http://www-s.ti.com/sc/ds/sn74ls245.pdf

## Nets that join several sheets
GND: Top (9 pins), Memmory Address Register (13 pins), Stack Address Register (21 pins), Address Mux (15 pins)
VCC: Top (9 pins), Memmory Address Register (5 pins), Stack Address Register (19 pins), Address Mux (15 pins)
ADDR0: Top (P1.6), Address Mux (U15.18 U17.18)
ADDR1: Top (P1.8), Address Mux (U15.17 U17.17)
ADDR2: Top (P1.10), Address Mux (U15.16 U17.16)
ADDR3: Top (P1.12), Address Mux (U15.15 U17.15)
ADDR4: Top (P1.14), Address Mux (U15.14 U17.14)
ADDR5: Top (P1.16), Address Mux (U15.13 U17.13)
ADDR6: Top (P1.18), Address Mux (U15.12 U17.12)
ADDR7: Top (P1.20), Address Mux (U15.11 U17.11)
ADDR8: Top (P1.22), Address Mux (U16.18 U18.18)
ADDR9: Top (P1.24), Address Mux (U16.17 U18.17)
ADDR10: Top (P1.26), Address Mux (U16.16 U18.16)
ADDR11: Top (P1.28), Address Mux (U16.15 U18.15)
ADDR12: Top (P1.30), Address Mux (U16.14 U18.14)
ADDR13: Top (P1.32), Address Mux (U16.13 U18.13)
ADDR14: Top (P1.34), Address Mux (U16.12 U18.12)
ADDR15: Top (P1.36), Address Mux (U16.11 U18.11)
BUS0: Top (P1.25), Stack Address Register (U11.3 U13.3 U19.18 U20.18)
BUS1: Top (P1.23), Stack Address Register (U11.4 U13.4 U19.17 U20.17)
BUS2: Top (P1.21), Stack Address Register (U11.5 U13.5 U19.16 U20.16)
BUS3: Top (P1.19), Stack Address Register (U11.6 U13.6 U19.15 U20.15)
BUS4: Top (P1.17), Stack Address Register (U12.3 U14.3 U19.14 U20.14)
BUS5: Top (P1.15), Stack Address Register (U12.4 U14.4 U19.13 U20.13)
BUS6: Top (P1.13), Stack Address Register (U12.5 U14.5 U19.12 U20.12)
BUS7: Top (P1.11), Stack Address Register (U12.6 U14.6 U19.11 U20.11)
CLK: Top (P1.5), Memmory Address Register (U1#2.7 U2#1.7 U3.7 U4.7), Stack Address Register (U11.2 U12.2 U13.2 U14.2)
DS#: Top (P1.48), Stack Address Register (5 pins)
IS#: Top (P1.46), Stack Address Register (U9.1)
LM: Top (U1#1.2), Stack Address Register (U10.5 U10.12)
LM#: Top (P1.9 U1#1.1), Stack Address Register (U10.2 U10.9)
LOAD: Top (P1.27), Address Mux (U2#2.11)
MI#: Top (P1.37), Address Mux (U2#2.12)
MO#: Top (P1.31), Address Mux (U9.4)
NI#: Top (P1.39), Stack Address Register (U1#1.9)
NO#: Top (P1.33), Stack Address Register (U1#1.11)
OUT#: Top (P1.29), Address Mux (U9.6)
SAR0: Stack Address Register (U11.14 U19.2), Address Mux (U17.2)
SAR1: Stack Address Register (U11.13 U19.3), Address Mux (U17.3)
SAR2: Stack Address Register (U11.12 U19.4), Address Mux (U17.4)
SAR3: Stack Address Register (U11.11 U19.5), Address Mux (U17.5)
SAR4: Stack Address Register (U12.14 U19.6), Address Mux (U17.6)
SAR5: Stack Address Register (U12.13 U19.7), Address Mux (U17.7)
SAR6: Stack Address Register (U12.12 U19.8), Address Mux (U17.8)
SAR7: Stack Address Register (U12.11 U19.9), Address Mux (U17.9)
SAR8: Stack Address Register (U13.14 U20.2), Address Mux (U18.2)
SAR9: Stack Address Register (U13.13 U20.3), Address Mux (U18.3)
SAR10: Stack Address Register (U13.12 U20.4), Address Mux (U18.4)
SAR11: Stack Address Register (U13.11 U20.5), Address Mux (U18.5)
SAR12: Stack Address Register (U14.14 U20.6), Address Mux (U18.6)
SAR13: Stack Address Register (U14.13 U20.7), Address Mux (U18.7)
SAR14: Stack Address Register (U14.12 U20.8), Address Mux (U18.8)
SAR15: Stack Address Register (U14.11 U20.9), Address Mux (U18.9)
SI#: Top (P1.41), Address Mux (U2#2.9 U2#2.13)
SO#: Top (P1.35), Address Mux (U2#2.10 U9.5)